# EAGLE design LEDS_PCB (EAGLE 7.5.0)
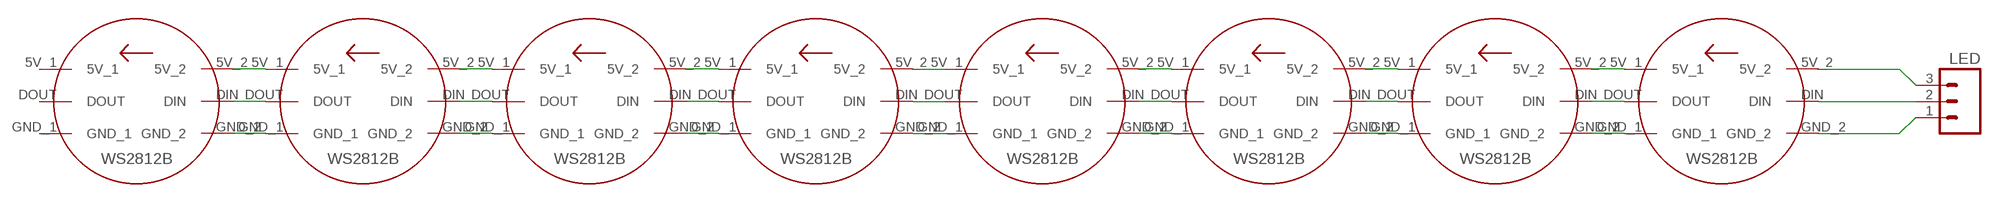
[diagram p0: schematic, sheet 1]

## Parts
LED  M03PTH  [1X03]
U$1  WS2812B_LED  [CIRCLE_PCB]
U$2  WS2812B_LED  [CIRCLE_PCB]
U$3  WS2812B_LED  [CIRCLE_PCB]
U$4  WS2812B_LED  [CIRCLE_PCB]
U$5  WS2812B_LED  [CIRCLE_PCB]
U$6  WS2812B_LED  [CIRCLE_PCB]
U$7  WS2812B_LED  [CIRCLE_PCB]
U$8  WS2812B_LED  [CIRCLE_PCB]

## Nets
N$8: U$1.5V_1 U$2.5V_2
N$9: U$1.DOUT U$2.DIN
N$10: U$1.GND_1 U$2.GND_2
N$11: U$2.5V_1 U$3.5V_2
N$12: U$2.DOUT U$3.DIN
N$13: U$2.GND_1 U$3.GND_2
N$14: U$3.5V_1 U$4.5V_2
N$15: U$3.DOUT U$4.DIN
N$16: U$3.GND_1 U$4.GND_2
N$17: U$5.5V_1 U$6.5V_2
N$18: U$5.DOUT U$6.DIN
N$19: U$5.GND_1 U$6.GND_2
N$20: U$6.5V_1 U$7.5V_2
N$21: U$6.DOUT U$7.DIN
N$22: U$6.GND_1 U$7.GND_2
N$23: U$7.5V_1 U$8.5V_2
N$24: U$7.DOUT U$8.DIN
N$25: U$7.GND_1 U$8.GND_2
N$26: U$4.5V_1 U$5.5V_2
N$27: U$4.DOUT U$5.DIN
N$28: U$4.GND_1 U$5.GND_2
N$29: LED.1 U$1.GND_2
N$30: LED.2 U$1.DIN
N$31: LED.3 U$1.5V_2
Unconnected: U$8.5V_1 U$8.DOUT U$8.GND_1

## Library data of the parts
LED = SparkFun-Connectors:M03: Header 3 Standard 3-pin 0.1" header. Use with straight break away headers (SKU : PRT-00116), right angle break away headers (PRT-00553), swiss pins (PRT-00743), machine pins (PRT-00117), and female headers (PRT-00115). Molex polarized connector foot print use with SKU : PRT-08232 with associated crimp pins and housings.
U$1-U$8 = RodrigoMarques_Parts:WS2812B_LED

## Net classes
0 default: width 0.254 mm

## Board
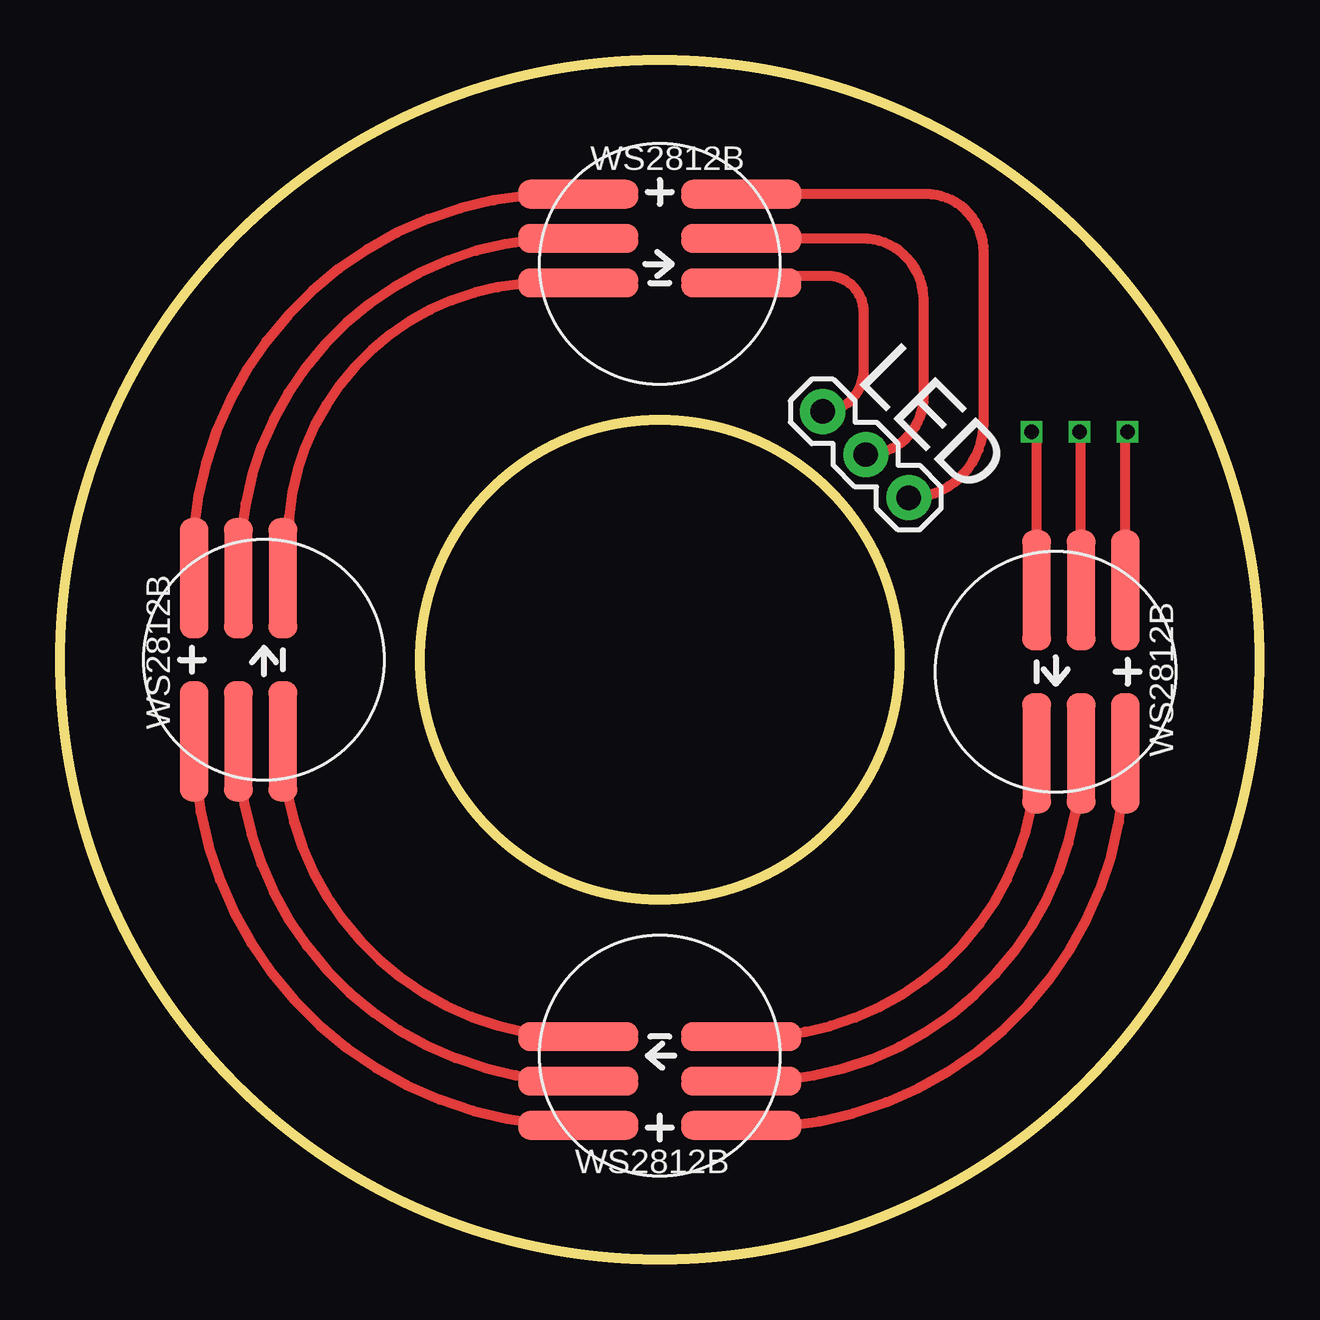
[diagram p1: board, top side]
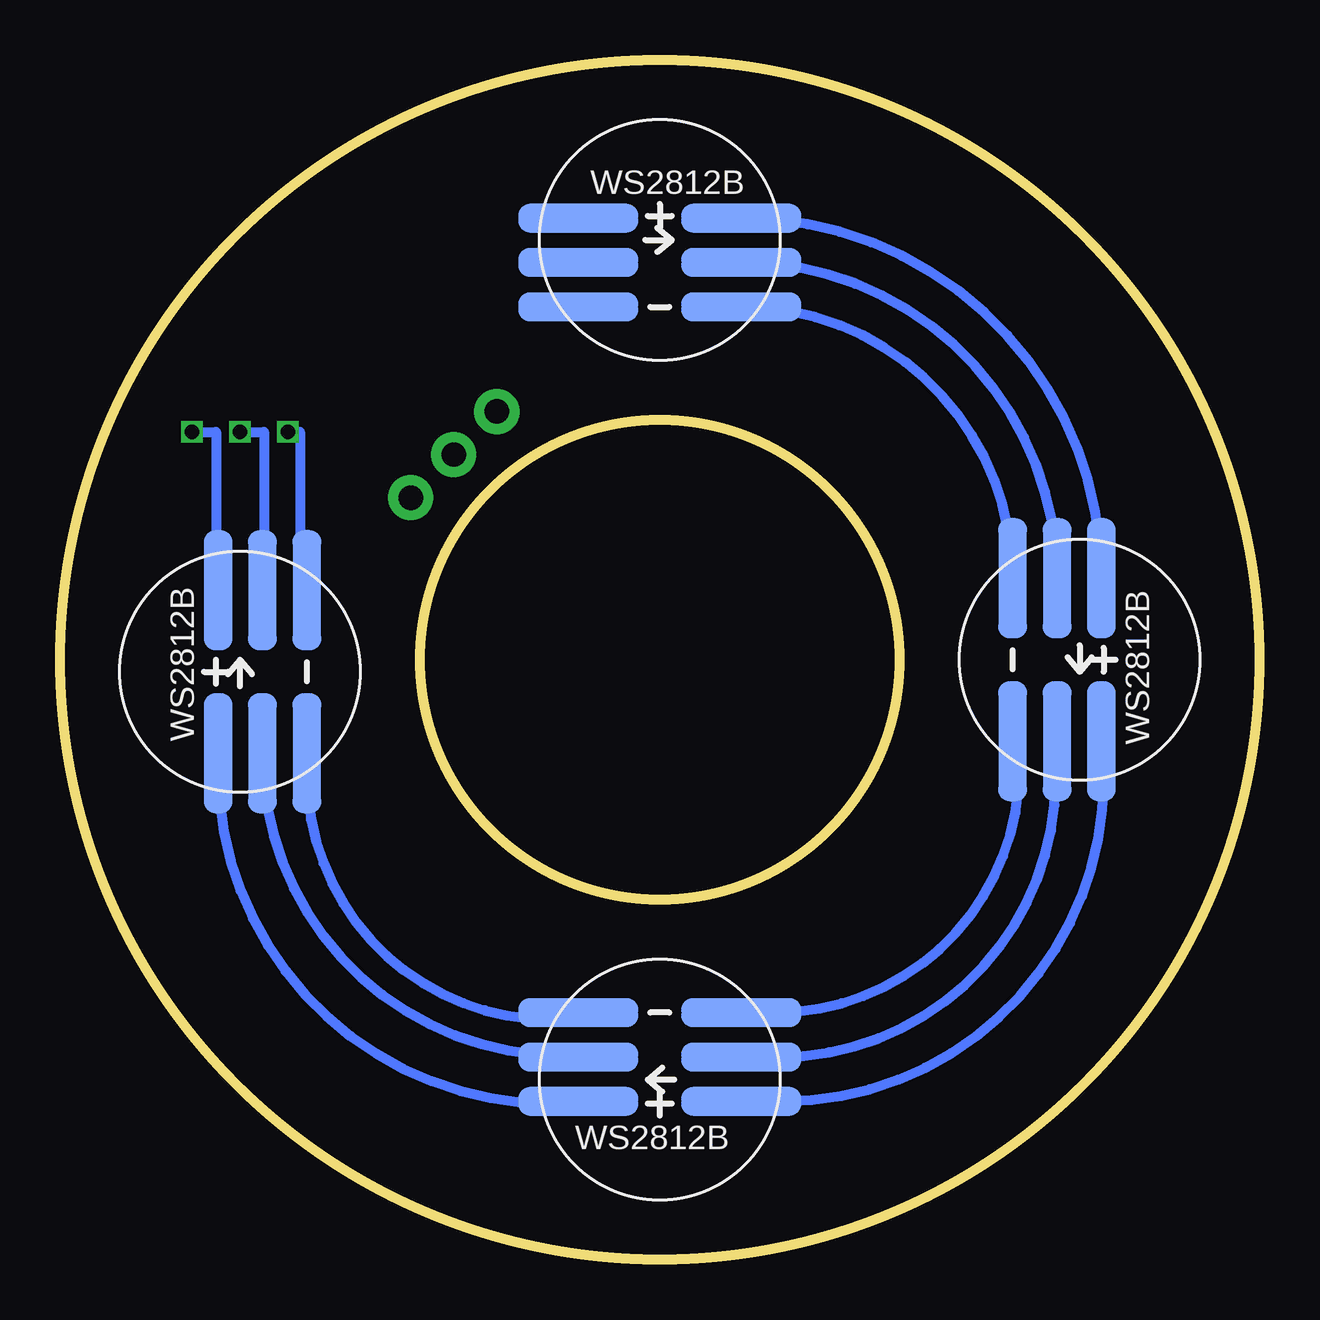
[diagram p2: board, bottom side, seen from below]

Size 50 x 50 mm. Coordinates in mm from the lower left corner, seen from the top.
Outline: circle at 25,25 radius 25
Outline: circle at 25,25 radius 10
Copper layers (1*16): Top 0.035mm / dielectric 1.5mm / Bottom 0.035mm
Design rules "seeedstudio_2l_gru": minimum track width 6mil, minimum drill 12mil, track to track 6mil, track to pad 6mil, pad to pad 6mil, via to via 6mil, smd to smd 0mil, copper to edge 10mil, drill to drill 10mil, minimum pad ring 10mil, minimum via ring 6mil, stop-mask expansion 2mil, vias tented up to drill 100mil, thermal gap 10mil

### Footprints (pad centres in the part's own frame; a part is rotated, then mirrored left to right if it is on the bottom)
1X03 = drill 1.016 pad 1.88: 1 0,0; 2 2.54,0; 3 5.08,0
CIRCLE_PCB = smd 5 x 1.2: 5V_1 -3.4,1.91; 5V_2 3.4,1.91; DIN 3.4,0.06; DOUT -3.4,0.06; GND_1 -3.4,-1.79; GND_2 3.4,-1.79

### Placement (x,y rotation side)
LED  31.79,35.35 315 top
U$1  25,42.5 0 top
U$2  7.5,25 90 top
U$3  25,7.5 180 top
U$4  42.5,24.5 270 top
U$5  41.5,24.5 90 bottom
U$6  25,8.5 180 bottom
U$7  8.5,25 270 bottom
U$8  25,41.5 0 bottom

### Tracks (layer width: path | path; a pad name or v marks a point on that pad's centre or on a via)
N$8
  Top 0.406: U$1.5V_1 20.91,44.41 arc90 5.5,29 5.5,28.49 arc90 U$2.5V_2
N$9
  Top 0.406: U$1.DOUT 21.06,42.56 arc90 7.5,29 7.5,28.46 arc-90 U$2.DIN
N$10
  Top 0.406: U$1.GND_1 20.21,40.71 arc90 9.5,30 9.5,28.61 arc-90 U$2.GND_2
N$11
  Top 0.406: U$2.5V_1 arc90 U$3.5V_2
N$12
  Top 0.406: U$2.DOUT arc90 U$3.DIN
N$13
  Top 0.406: U$2.GND_1 arc90 U$3.GND_2
N$14
  Top 0.406: U$3.5V_1 28.09,5.59 arc90 28,5.5 28.81,5.5 arc90 U$4.5V_2
N$15
  Top 0.406: U$3.DOUT 28.9,7.44 arc90 U$4.DIN
N$16
  Top 0.406: U$3.GND_1 28.9,9.29 arc90 U$4.GND_2
N$17
  Bottom 0.406: U$5.5V_1 43.41,20.41 arc-90 29.5,6.5 28.49,6.5 arc-90 U$6.5V_2
N$18
  Bottom 0.406: U$5.DOUT 41.56,21.06 arc-90 29,8.5 28.46,8.5 arc90 U$6.DIN
N$19
  Bottom 0.406: U$5.GND_1 39.71,20.21 arc-90 29.5,10 28.69,10 arc-90 U$6.GND_2
N$20
  Bottom 0.406: U$6.5V_1 19.91,6.59 arc-90 6.5,20 6.5,21.51 arc-90 U$7.5V_2
N$21
  Bottom 0.406: U$6.DOUT 20.06,8.44 arc-90 8.5,20 8.5,21.54 arc90 U$7.DIN
N$22
  Bottom 0.406: U$6.GND_1 20.21,10.29 arc-90 10,20.5 10,21.31 arc-90 U$7.GND_2
N$23
  Bottom 0.406: U$7.5V_1 arc-90 U$8.5V_2
N$24
  Bottom 0.406: U$7.DOUT arc-90 U$8.DIN
N$25
  Bottom 0.406: U$7.GND_1 arc-90 U$8.GND_2
N$26  (via drill 0.6)
  Top 0.406: U$4.5V_1 44.41,34.41 arc-90 v44.5,34.5
  Bottom 0.406: v44.5,34.5 43.5,34.5 43.5,27.99 arc-90 U$5.5V_2
N$27  (via drill 0.6)
  Top 0.406: U$4.DOUT 42.56,34.44 arc90 v42.5,34.5
  Bottom 0.406: v42.5,34.5 41.5,34.5 41.5,27.96 arc90 U$5.DIN
N$28  (via drill 0.6)
  Top 0.406: U$4.GND_1 40.71,34.29 arc90 v40.5,34.5
  Bottom 0.406: v40.5,34.5 40,34.5 40,28.19 arc-90 U$5.GND_2
N$29
  Top 0.406: LED.1 arc90 33.5,37.06 33.5,39.5 arc90 32,41 30.5,41 arc-90 30.21,40.71 U$1.GND_2
N$30
  Top 0.406: LED.2 arc90 36,35.97 36,40 arc90 33.44,42.56 U$1.DIN
N$31
  Top 0.406: LED.3 arc90 38.5,34.88 38.5,42 arc90 36.09,44.41 U$1.5V_2